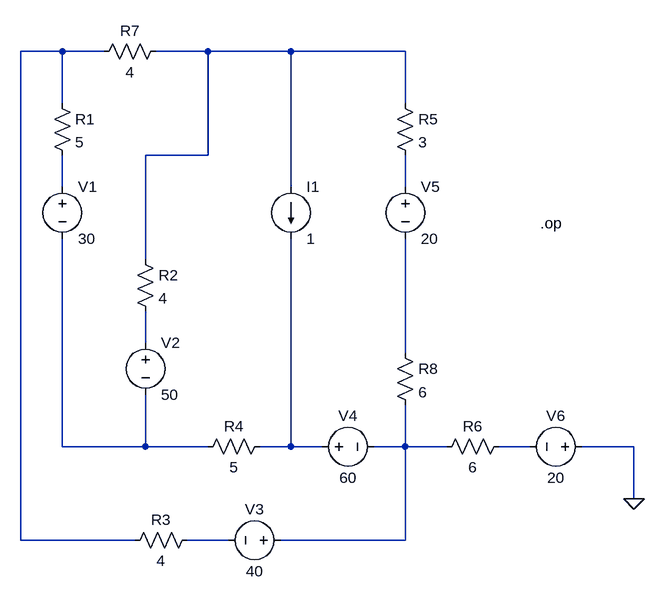
[diagram p0: schematic hw_1.asc]
hw_1.asc, the LTspice schematic file:
Version 4
SHEET 1 1032 760
WIRE 32 -144 -32 -144
WIRE 96 -144 32 -144
WIRE 256 -144 176 -144
WIRE 384 -144 256 -144
WIRE 560 -144 384 -144
WIRE 32 -64 32 -144
WIRE 560 -64 560 -144
WIRE 256 16 256 -144
WIRE 256 16 160 16
WIRE 32 64 32 16
WIRE 384 64 384 -144
WIRE 560 64 560 16
WIRE 160 176 160 16
WIRE 160 304 160 256
WIRE 560 320 560 144
WIRE 32 464 32 144
WIRE 160 464 160 384
WIRE 160 464 32 464
WIRE 256 464 160 464
WIRE 384 464 384 144
WIRE 384 464 336 464
WIRE 432 464 384 464
WIRE 560 464 560 400
WIRE 560 464 512 464
WIRE 624 464 560 464
WIRE 752 464 704 464
WIRE 912 464 832 464
WIRE 912 544 912 464
WIRE -32 608 -32 -144
WIRE 144 608 -32 608
WIRE 288 608 224 608
WIRE 560 608 560 464
WIRE 560 608 368 608
FLAG 912 544 0
DATAFLAG 560 224 ""
DATAFLAG 544 -144 ""
DATAFLAG 912 464 ""
DATAFLAG -32 608 ""
SYMBOL voltage 32 48 R0
WINDOW 123 0 0 Left 0
WINDOW 39 0 0 Left 0
SYMATTR InstName V1
SYMATTR Value 30
SYMBOL res 16 -80 R0
SYMATTR InstName R1
SYMATTR Value 5
SYMBOL voltage 160 288 R0
WINDOW 123 0 0 Left 0
WINDOW 39 0 0 Left 0
SYMATTR InstName V2
SYMATTR Value 50
SYMBOL res 144 160 R0
SYMATTR InstName R2
SYMATTR Value 4
SYMBOL voltage 384 608 R90
WINDOW 0 -32 56 VBottom 2
WINDOW 3 32 56 VTop 2
WINDOW 123 0 0 Left 0
WINDOW 39 0 0 Left 0
SYMATTR InstName V3
SYMATTR Value 40
SYMBOL voltage 416 464 R270
WINDOW 0 32 56 VTop 2
WINDOW 3 -32 56 VBottom 2
WINDOW 123 0 0 Left 0
WINDOW 39 0 0 Left 0
SYMATTR InstName V4
SYMATTR Value 60
SYMBOL res 240 592 R90
WINDOW 0 0 56 VBottom 2
WINDOW 3 32 56 VTop 2
SYMATTR InstName R3
SYMATTR Value 4
SYMBOL res 352 448 R90
WINDOW 0 0 56 VBottom 2
WINDOW 3 32 56 VTop 2
SYMATTR InstName R4
SYMATTR Value 5
SYMBOL voltage 560 48 R0
WINDOW 123 0 0 Left 0
WINDOW 39 0 0 Left 0
SYMATTR InstName V5
SYMATTR Value 20
SYMBOL res 544 -80 R0
SYMATTR InstName R5
SYMATTR Value 3
SYMBOL res 720 448 R90
WINDOW 0 0 56 VBottom 2
WINDOW 3 32 56 VTop 2
SYMATTR InstName R6
SYMATTR Value 6
SYMBOL voltage 848 464 R90
WINDOW 0 -32 56 VBottom 2
WINDOW 3 32 56 VTop 2
WINDOW 123 0 0 Left 0
WINDOW 39 0 0 Left 0
SYMATTR InstName V6
SYMATTR Value 20
SYMBOL res 192 -160 R90
WINDOW 0 0 56 VBottom 2
WINDOW 3 32 56 VTop 2
SYMATTR InstName R7
SYMATTR Value 4
SYMBOL current 384 64 R0
WINDOW 123 0 0 Left 0
WINDOW 39 0 0 Left 0
SYMATTR InstName I1
SYMATTR Value 1
SYMBOL res 544 304 R0
SYMATTR InstName R8
SYMATTR Value 6
TEXT 768 120 Left 2 !.op

The netlist it stands for:
* hw_1.asc
V1 N003 N007 30
R1 N001 N003 5
V2 N005 N007 50
R2 N002 N005 4
V3 N009 N011 40
V4 N008 N009 60
R3 N011 N001 4
R4 N008 N007 5
V5 N004 N006 20
R5 N002 N004 3
R6 N010 N009 6
V6 0 N010 20
R7 N002 N001 4
I1 N002 N008 1
R8 N006 N009 6
.op
.backanno
.end